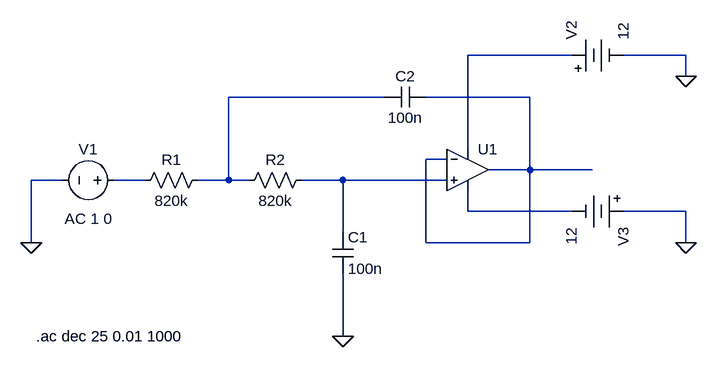
[diagram p0: schematic Sallen-Key_LowPass_UnityGain.asc]
Sallen-Key_LowPass_UnityGain.asc, the LTspice schematic file:
Version 4
SHEET 1 932 680
WIRE 640 -64 480 -64
WIRE 816 -64 720 -64
WIRE 816 -32 816 -64
WIRE 352 0 112 0
WIRE 576 0 416 0
WIRE 480 80 480 -64
WIRE 448 96 416 96
WIRE 576 112 576 0
WIRE 576 112 512 112
WIRE 672 112 576 112
WIRE -144 128 -192 128
WIRE -16 128 -64 128
WIRE 112 128 112 0
WIRE 112 128 64 128
WIRE 144 128 112 128
WIRE 288 128 224 128
WIRE 448 128 288 128
WIRE 480 176 480 144
WIRE 640 176 480 176
WIRE 816 176 720 176
WIRE 288 208 288 128
WIRE -192 224 -192 128
WIRE 416 224 416 96
WIRE 576 224 576 112
WIRE 576 224 416 224
WIRE 816 224 816 176
WIRE 288 368 288 272
FLAG 288 368 0
FLAG -192 224 0
FLAG 816 -32 0
FLAG 816 224 0
SYMBOL res 80 112 R90
WINDOW 0 0 56 VBottom 2
WINDOW 3 32 56 VTop 2
SYMATTR InstName R1
SYMATTR Value 820k
SYMBOL res 240 112 R90
WINDOW 0 0 56 VBottom 2
WINDOW 3 32 56 VTop 2
SYMATTR InstName R2
SYMATTR Value 820k
SYMBOL cap 272 208 R0
SYMATTR InstName C1
SYMATTR Value 100n
SYMBOL cap 416 -16 R90
WINDOW 0 0 32 VBottom 2
WINDOW 3 32 32 VTop 2
SYMATTR InstName C2
SYMATTR Value 100n
SYMBOL voltage -48 128 R90
WINDOW 0 -32 56 VBottom 2
WINDOW 3 88 56 VTop 2
WINDOW 123 44 56 VTop 2
WINDOW 39 0 0 Left 0
SYMATTR InstName V1
SYMATTR Value ""
SYMATTR Value2 AC 1 0
SYMBOL OpAmps\\UniversalOpAmp2 480 112 R0
SYMATTR InstName U1
SYMBOL Misc\\battery 624 -64 R270
WINDOW 123 0 0 Left 0
WINDOW 39 0 0 Left 0
SYMATTR InstName V2
SYMATTR Value 12
SYMBOL Misc\\battery 736 176 R90
WINDOW 123 0 0 Left 0
WINDOW 39 0 0 Left 0
SYMATTR InstName V3
SYMATTR Value 12
TEXT -184 368 Left 2 !.ac dec 25 0.01 1000

The netlist it stands for:
* Sallen-Key_LowPass_UnityGain.asc
R1 N002 N004 820k
R2 N005 N002 820k
C1 N005 0 100n
C2 N003 N002 100n
V1 N004 0 AC 1 0
XU1 N005 N003 N001 N006 N003 level2 Avol=1Meg GBW=10Meg Slew=10Meg Ilimit=25m Rail=0 Vos=0 En=0 Enk=0 In=0 Ink=0 Rin=500Meg  ; pins In+ In- V+ V- OUT
V2 N001 0 12
V3 0 N006 12
.ac dec 25 0.01 1000
.lib UniversalOpAmp2.lib
.backanno
.end